# Altium schematic sheet AD9361.SchDoc
size B; SheetNumber: 2; SheetTotal: 5
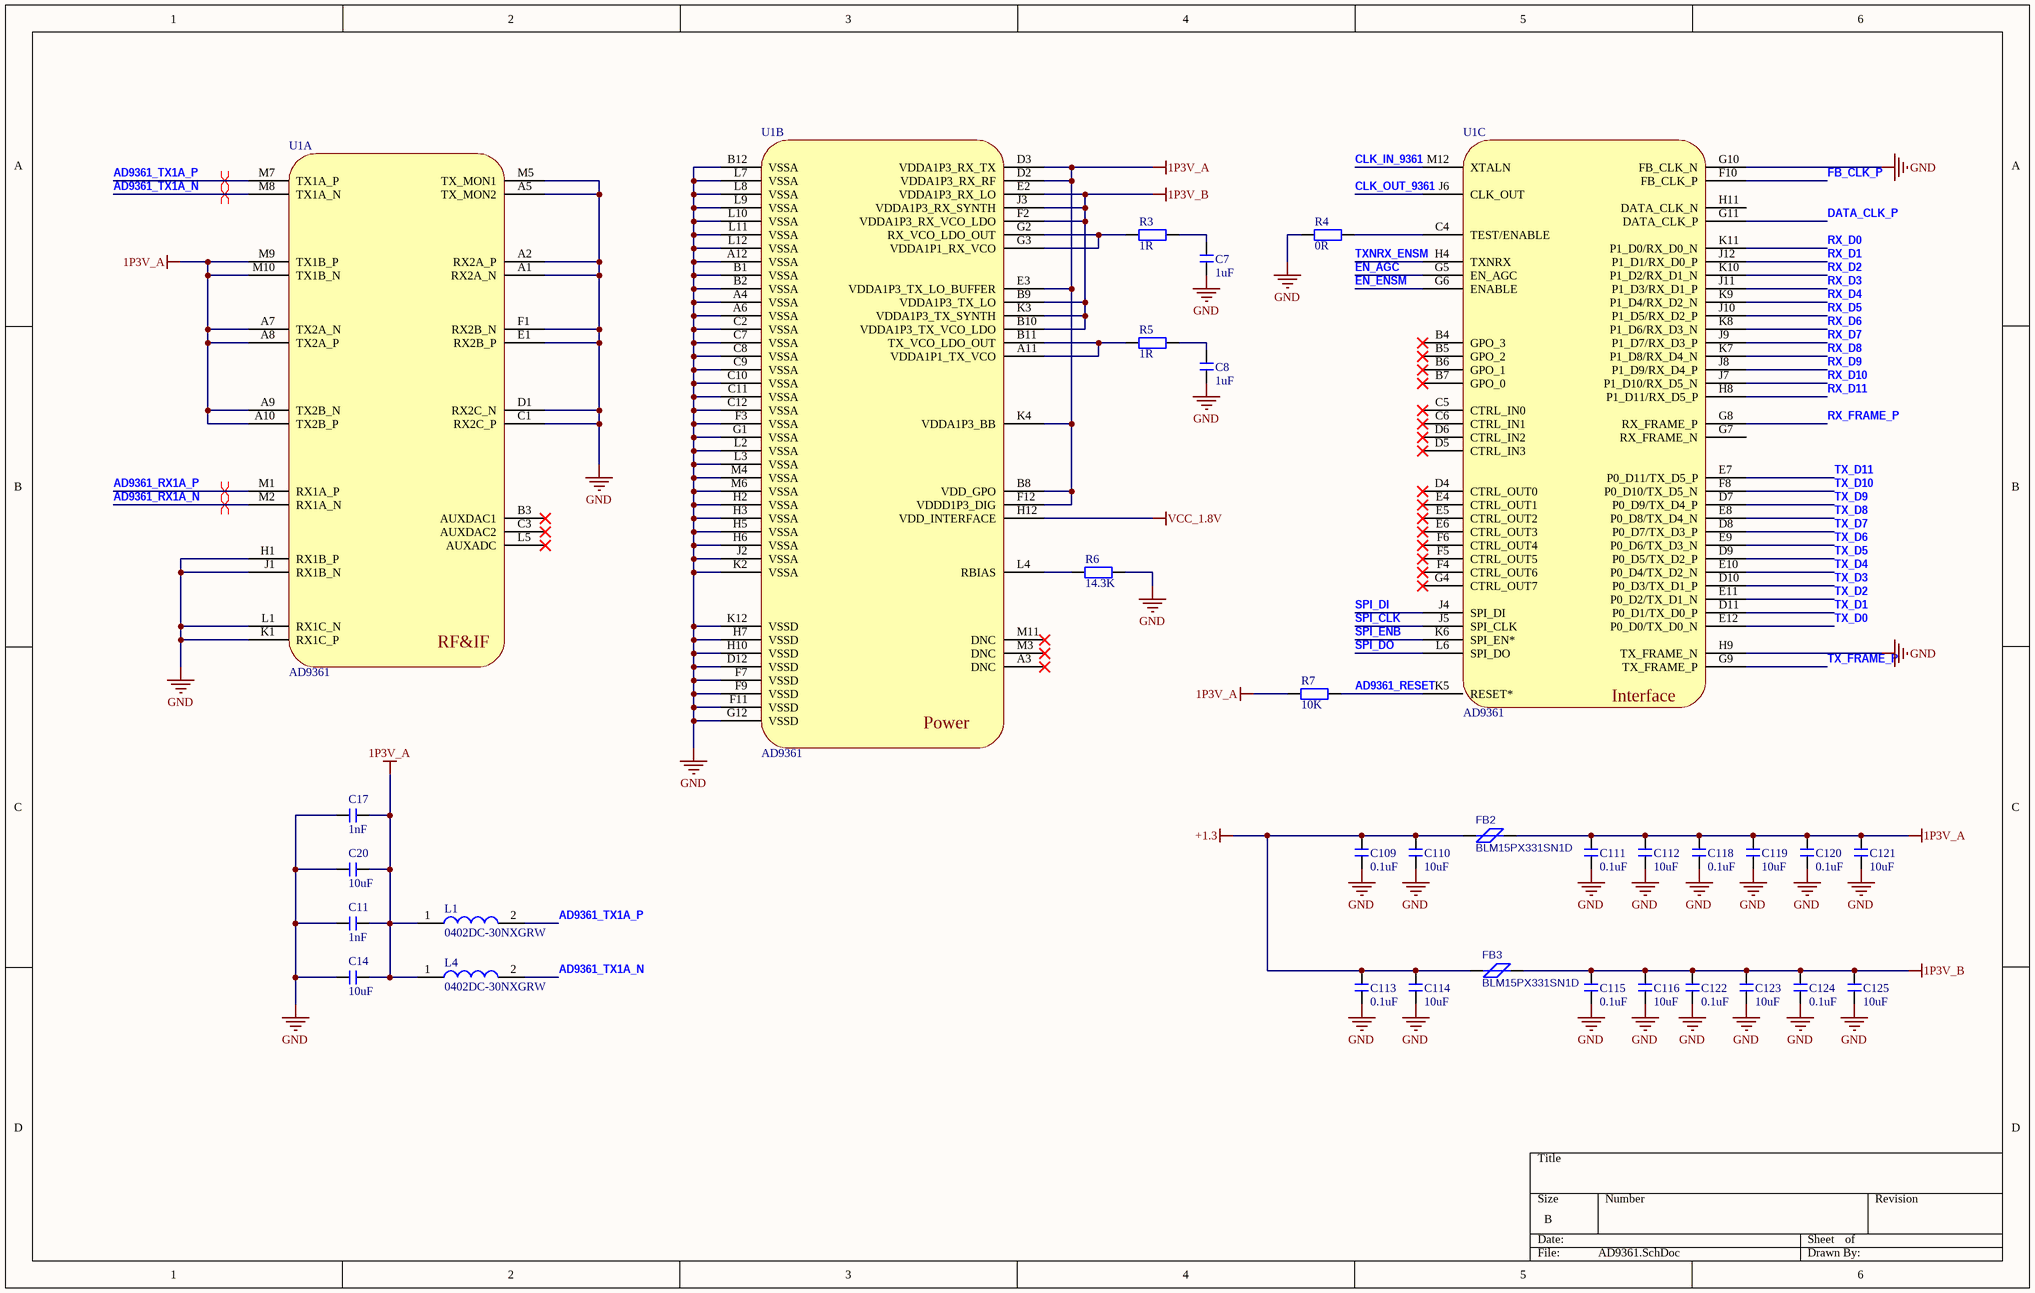
[diagram p0: AD9361.SchDoc]

## Parts
C7  1uF  [CAP_0402]
C8  1uF  [CAP_0402]
C11  1nF  [CAP_0201]
C14  10uF  [CAP_0402]
C17  1nF  [CAP_0201]
C20  10uF  [CAP_0402]
C109  0.1uF  [CAP_0402]
C110  10uF  [CAP_0402]
C111  0.1uF  [CAP_0201]
C112  10uF  [CAP_0201]
C113  0.1uF  [CAP_0402]
C114  10uF  [CAP_0402]
C115  0.1uF  [CAP_0201]
C116  10uF  [CAP_0201]
C118  0.1uF  [CAP_0201]
C119  10uF  [CAP_0201]
C120  0.1uF  [CAP_0201]
C121  10uF  [CAP_0201]
C122  0.1uF  [CAP_0201]
C123  10uF  [CAP_0201]
C124  0.1uF  [CAP_0201]
C125  10uF  [CAP_0201]
FB2  BLM15PX331SN1D  [0402]
FB3  BLM15PX331SN1D  [0402]
L1  0402DC-30NXGRW  [0402DC SERIES]
L4  0402DC-30NXGRW  [0402DC SERIES]
R3  value 1R  [RES_0201]  (hidden comment: Resistor)
R4  value 0R  [RES_0201]  (hidden comment: Resistor)
R5  value 1R  [RES_0201]  (hidden comment: Resistor)
R6  value 14.3K  [RES_0402]  (hidden comment: Resistor)
R7  value 10K  [RES_0201]  (hidden comment: Resistor)
U1  AD9361  [AD936X]  (parts A,B,C of 3)

## Nets
1P3V_A: C11.2 C14.2 C17.2 C20.2 C111.1 C112.2 C118.1 C119.2 C120.1 C121.2 FB2.2 L1.1 L4.1 R7.2 U1.A7(TX2A_N) U1.A8(TX2A_P) U1.A9(TX2B_N) U1.A10(TX2B_P) U1.B8(VDD_GPO) U1.D2(VDDA1P3_RX_RF) U1.D3(VDDA1P3_RX_TX) U1.E3(VDDA1P3_TX_LO_BUFFER) U1.F12(VDDD1P3_DIG) U1.K4(VDDA1P3_BB) U1.M9(TX1B_P) U1.M10(TX1B_N)
1P3V_B: C115.1 C116.2 C122.1 C123.2 C124.1 C125.2 FB3.2 U1.B9(VDDA1P3_TX_LO) U1.B10(VDDA1P3_TX_VCO_LDO) U1.E2(VDDA1P3_RX_LO) U1.F2(VDDA1P3_RX_VCO_LDO) U1.J3(VDDA1P3_RX_SYNTH) U1.K3(VDDA1P3_TX_SYNTH)
+1.3: C109.1 C110.2 C113.1 C114.2 FB2.1 FB3.1
GND: C7.1 C8.1 C11.1 C14.1 C17.1 C20.1 C109.2 C110.1 C111.2 C112.1 C113.2 C114.1 C115.2 C116.1 C118.2 C119.1 C120.2 C121.1 C122.2 C123.1 C124.2 C125.1 R4.2 R6.1 U1.A1(RX2A_N) U1.A2(RX2A_P) U1.A4(VSSA) U1.A5(TX_MON2) U1.A6(VSSA) U1.A12(VSSA) U1.B1(VSSA) U1.B2(VSSA) U1.B12(VSSA) U1.C1(RX2C_P) U1.C2(VSSA) U1.C7(VSSA) U1.C8(VSSA) U1.C9(VSSA) U1.C10(VSSA) U1.C11(VSSA) U1.C12(VSSA) U1.D1(RX2C_N) U1.D12(VSSD) U1.E1(RX2B_P) U1.F1(RX2B_N) U1.F3(VSSA) U1.F7(VSSD) U1.F9(VSSD) U1.F11(VSSD) U1.G1(VSSA) U1.G10(FB_CLK_N) U1.G12(VSSD) U1.H1(RX1B_P) U1.H2(VSSA) U1.H3(VSSA) U1.H5(VSSA) U1.H6(VSSA) U1.H7(VSSD) U1.H9(TX_FRAME_N) U1.H10(VSSD) U1.J1(RX1B_N) U1.J2(VSSA) U1.K1(RX1C_P) U1.K2(VSSA) U1.K12(VSSD) U1.L1(RX1C_N) U1.L2(VSSA) U1.L3(VSSA) U1.L7(VSSA) U1.L8(VSSA) U1.L9(VSSA) U1.L10(VSSA) U1.L11(VSSA) U1.L12(VSSA) U1.M4(VSSA) U1.M5(TX_MON1) U1.M6(VSSA)
VCC_1.8V: U1.H12(VDD_INTERFACE)
AD9361_RESET: R7.1 U1.K5(RESET*)
AD9361_RX1A_N: U1.M2(RX1A_N)
AD9361_RX1A_P: U1.M1(RX1A_P)
AD9361_TX1A_N: L4.2 U1.M8(TX1A_N)
AD9361_TX1A_P: L1.2 U1.M7(TX1A_P)
CLK_IN_9361: U1.M12(XTALN)
CLK_OUT_9361: U1.J6(CLK_OUT)
DATA_CLK_P: U1.G11(DATA_CLK_P)
EN_AGC: U1.G5(EN_AGC)
EN_ENSM: U1.G6(ENABLE)
FB_CLK_P: U1.F10(FB_CLK_P)
RX_D0: U1.K11(P1_D0/RX_D0_N)
RX_D1: U1.J12(P1_D1/RX_D0_P)
RX_D2: U1.K10(P1_D2/RX_D1_N)
RX_D3: U1.J11(P1_D3/RX_D1_P)
RX_D4: U1.K9(P1_D4/RX_D2_N)
RX_D5: U1.J10(P1_D5/RX_D2_P)
RX_D6: U1.K8(P1_D6/RX_D3_N)
RX_D7: U1.J9(P1_D7/RX_D3_P)
RX_D8: U1.K7(P1_D8/RX_D4_N)
RX_D9: U1.J8(P1_D9/RX_D4_P)
RX_D10: U1.J7(P1_D10/RX_D5_N)
RX_D11: U1.H8(P1_D11/RX_D5_P)
RX_FRAME_P: U1.G8(RX_FRAME_P)
SPI_CLK: U1.J5(SPI_CLK)
SPI_DI: U1.J4(SPI_DI)
SPI_DO: U1.L6(SPI_DO)
SPI_ENB: U1.K6(SPI_EN*)
TX_D0: U1.E12(P0_D0/TX_D0_N)
TX_D1: U1.D11(P0_D1/TX_D0_P)
TX_D2: U1.E11(P0_D2/TX_D1_N)
TX_D3: U1.D10(P0_D3/TX_D1_P)
TX_D4: U1.E10(P0_D4/TX_D2_N)
TX_D5: U1.D9(P0_D5/TX_D2_P)
TX_D6: U1.E9(P0_D6/TX_D3_N)
TX_D7: U1.D8(P0_D7/TX_D3_P)
TX_D8: U1.E8(P0_D8/TX_D4_N)
TX_D9: U1.D7(P0_D9/TX_D4_P)
TX_D10: U1.F8(P0_D10/TX_D5_N)
TX_D11: U1.E7(P0_D11/TX_D5_P)
TX_FRAME_P: U1.G9(TX_FRAME_P)
TXNRX_ENSM: U1.H4(TXNRX)
NetC7_2: C7.2 R3.1
NetC8_2: C8.2 R5.1
NetR3_2: R3.2 U1.G2(RX_VCO_LDO_OUT) U1.G3(VDDA1P1_RX_VCO)
NetR4_1: R4.1 U1.C4(TEST/ENABLE)
NetR5_2: R5.2 U1.A11(VDDA1P1_TX_VCO) U1.B11(TX_VCO_LDO_OUT)
NetR6_2: R6.2 U1.L4(RBIAS)

Not connected (* = marked no-connect by the designer): U1 A3(DNC)* B3(AUXDAC1)* B4(GPO_3)* B5(GPO_2)* B6(GPO_1)* B7(GPO_0)* C3(AUXDAC2)* C5(CTRL_IN0)* C6(CTRL_IN1)* D4(CTRL_OUT0)* D5(CTRL_IN3)* D6(CTRL_IN2)* E4(CTRL_OUT1)* E5(CTRL_OUT2)* E6(CTRL_OUT3)* F4(CTRL_OUT6)* F5(CTRL_OUT5)* F6(CTRL_OUT4)* G4(CTRL_OUT7)* G7(RX_FRAME_N) H11(DATA_CLK_N) L5(AUXADC)* M3(DNC)* M11(DNC)*

## Layout directives
differential pair: AD9361_RX1A_N, AD9361_RX1A_P, AD9361_TX1A_N, AD9361_TX1A_P

## Notes on the sheet
- (in symbol AD9363, part A) RF&IF
- (in symbol AD9363, part B) Power
- (in symbol AD9363, part C) Interface

## Library data of the parts
C7 C8 C11 C14 C17 C20 C109-C116 C118-C125 = C: 无极性贴片电容; 版权归属: 源创客; BOM名称: 无极性贴片电容; 学习资源: www.ooocke.com
FB2 FB3 = BLM15PX331SN1D: 330 Ohms @ 100 MHz 1 Power Line Ferrite Bead 0402 (1005 Metric) 1.2A 150mOhm from Murata Electronics; Contributor: LCSC; BOM_Supplier: LCSC; BOM_Supplier Part: C160975; BOM_Manufacturer: Murata Electronics; BOM_Manufacturer Part: BLM15PX331SN1D; spicePre: U; spiceSymbolName: BLM15PX331SN1D
L1 L4 = 0402DC-36NXJRW: Inductor; Manufacturer_Name: COILCRAFT; Datasheet Link: https://componentsearchengine.com/Datasheets/1/0402DC-36NXJRW.pdf; Height: 0.65mm; Manufacturer_Part_Number: 0402DC-36NXJRW; Mouser Part Number: 994-0402DC-36NXJRW; Mouser Price/Stock: https://www.mouser.co.uk/ProductDetail/Coilcraft/0402DC-36NXJRW?qs=wnTfsH77Xs5b4nmRQW6u0w%3D%3D
U1 = AD9363